# EAGLE schematic alu3 2 (EAGLE 7.6.0)
ALU

## Sheet 1 of 8: ALU CORE
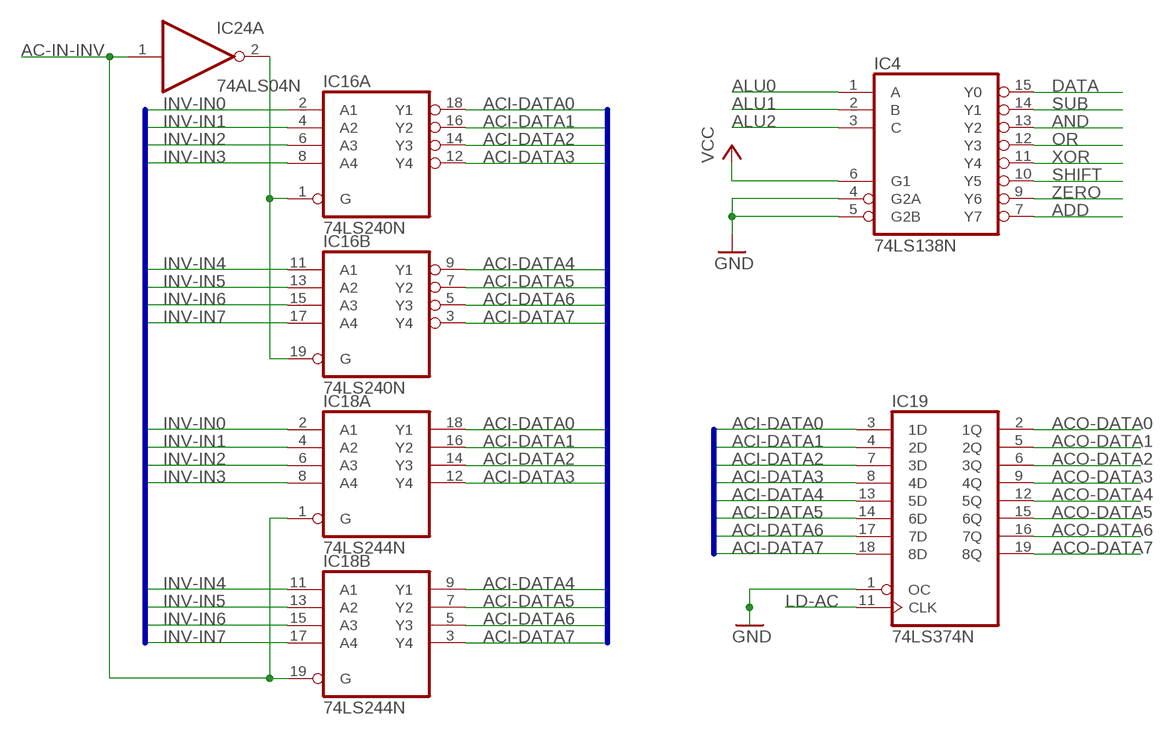
[diagram p0: schematic, sheet 1]

### Parts
IC4  74LS138N  [DIL16]
IC16  74LS240N  [DIL20]
IC18  74LS244N  [DIL20]
IC19  74LS374N  [DIL20]
IC24  74ALS04N  [DIL14]

### Nets
AC-IN-INV: IC18.1(A:G) IC18.19(B:G) IC24.1(A:I) ; also sheet 2,6
ACI-DATA0: IC16.18(A:Y1) IC18.18(A:Y1) IC19.3(1D)
ACI-DATA1: IC16.16(A:Y2) IC18.16(A:Y2) IC19.4(2D)
ACI-DATA2: IC16.14(A:Y3) IC18.14(A:Y3) IC19.7(3D)
ACI-DATA3: IC16.12(A:Y4) IC18.12(A:Y4) IC19.8(4D)
ACI-DATA4: IC16.9(B:Y1) IC18.9(B:Y1) IC19.13(5D)
ACI-DATA5: IC16.7(B:Y2) IC18.7(B:Y2) IC19.14(6D)
ACI-DATA6: IC16.5(B:Y3) IC18.5(B:Y3) IC19.17(7D)
ACI-DATA7: IC16.3(B:Y4) IC18.3(B:Y4) IC19.18(8D)
ACO-DATA0: IC19.2(1Q) ; also sheet 4,5,6,8
ACO-DATA1: IC19.5(2Q) ; also sheet 4,5,6,8
ACO-DATA2: IC19.6(3Q) ; also sheet 4,5,6,8
ACO-DATA3: IC19.9(4Q) ; also sheet 4,5,6,8
ACO-DATA4: IC19.12(5Q) ; also sheet 4,5,6,8
ACO-DATA5: IC19.15(6Q) ; also sheet 4,5,6,8
ACO-DATA6: IC19.16(7Q) ; also sheet 4,5,6,8
ACO-DATA7: IC19.19(8Q) ; also sheet 4,5,6,8
ADD: IC4.7(Y7) ; also sheet 8
ALU0: IC4.1(A) ; also sheet 2,6,7
ALU1: IC4.2(B) ; also sheet 2,6,7
ALU2: IC4.3(C) ; also sheet 2,6,7
AND: IC4.13(Y2) ; also sheet 5
DATA: IC4.15(Y0) ; also sheet 4
GND: IC4.4(G2A) IC4.5(G2B) IC19.1(OC) ; also sheet 2,5,6,7
INV-IN0: IC16.2(A:A1) IC18.2(A:A1) ; also sheet 4,5,7,8
INV-IN1: IC16.4(A:A2) IC18.4(A:A2) ; also sheet 4,5,7,8
INV-IN2: IC16.6(A:A3) IC18.6(A:A3) ; also sheet 4,5,7,8
INV-IN3: IC16.8(A:A4) IC18.8(A:A4) ; also sheet 4,5,7,8
INV-IN4: IC16.11(B:A1) IC18.11(B:A1) ; also sheet 4,5,7,8
INV-IN5: IC16.13(B:A2) IC18.13(B:A2) ; also sheet 4,5,7,8
INV-IN6: IC16.15(B:A3) IC18.15(B:A3) ; also sheet 4,5,7,8
INV-IN7: IC16.17(B:A4) IC18.17(B:A4) ; also sheet 4,5,7,8
LD-AC: IC19.11(CLK) ; also sheet 2
N$42: IC16.1(A:G) IC16.19(B:G) IC24.2(A:O)
OR: IC4.12(Y3) ; also sheet 5
SHIFT: IC4.10(Y5) ; also sheet 7
SUB: IC4.14(Y1) ; also sheet 8
VCC: IC4.6(G1) ; also sheet 2,6,7
XOR: IC4.11(Y4) ; also sheet 5
ZERO: IC4.9(Y6) ; also sheet 5
Unconnected: IC24.12(F:O) IC24.13(F:I)

### Buses
INV-IN[0..7]
ACI-DATA[0..7]

## Sheet 2 of 8: BUS
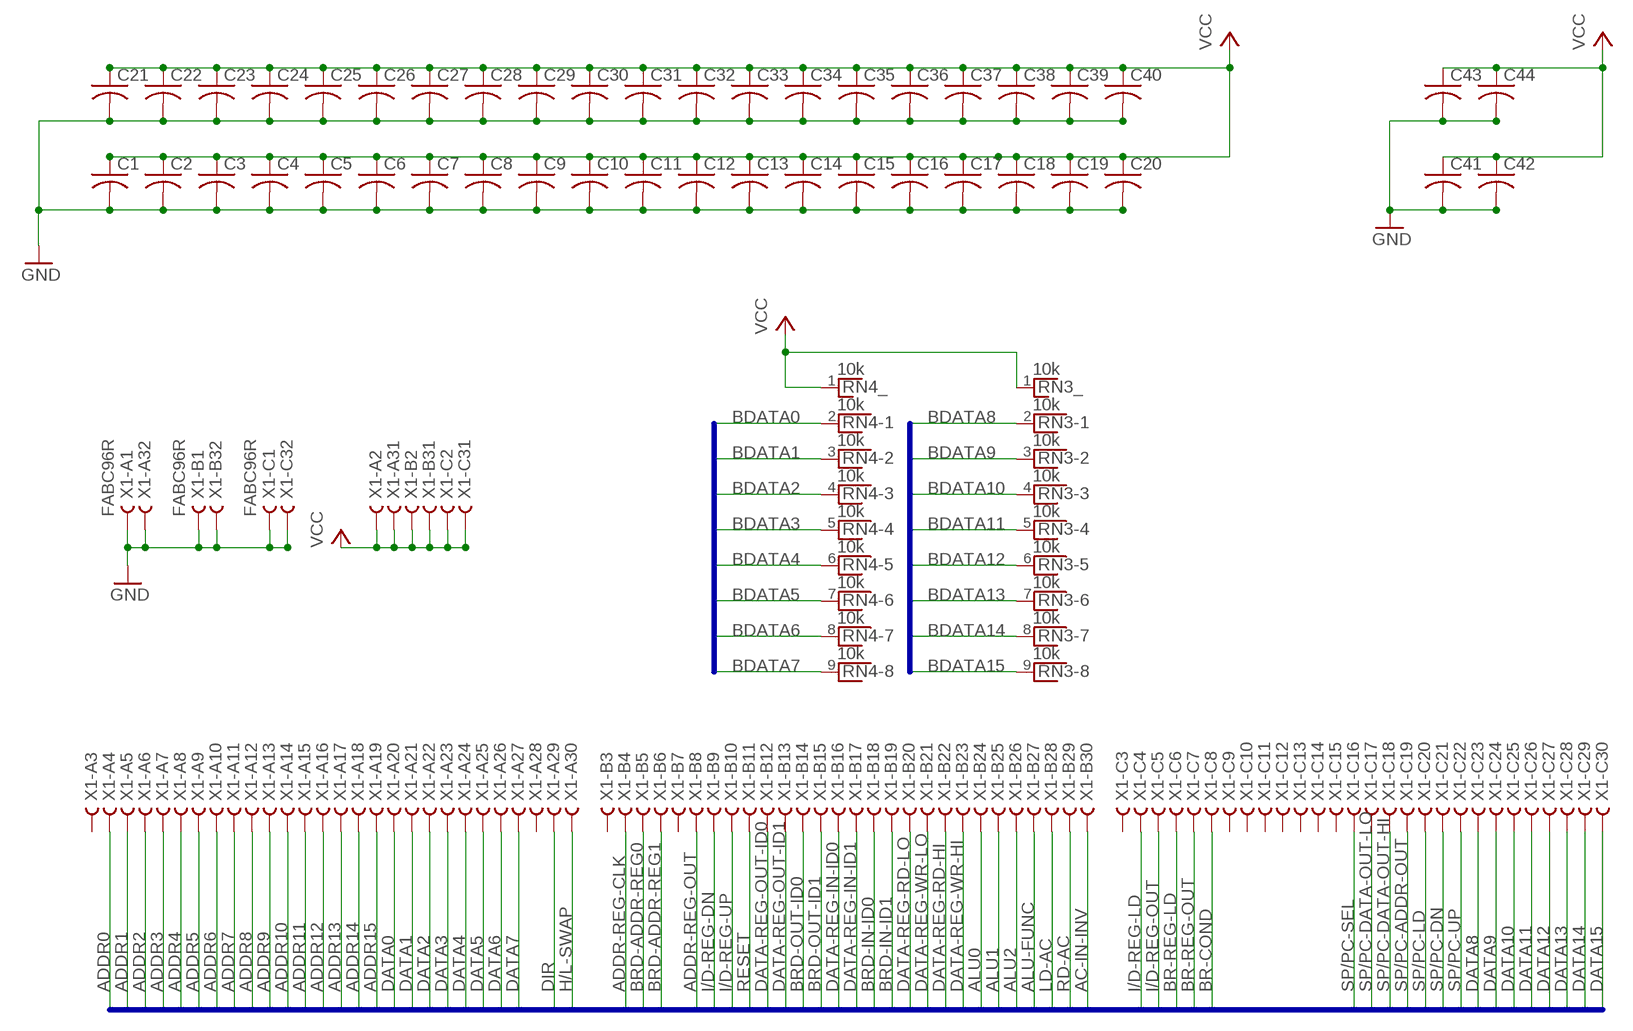
[diagram p1: schematic, sheet 2]

### Parts
C1  C-US025-024X044  [C025-024X044]
C2  C-US025-024X044  [C025-024X044]
C3  C-US025-024X044  [C025-024X044]
C4  C-US025-024X044  [C025-024X044]
C5  C-US025-024X044  [C025-024X044]
C6  C-US025-024X044  [C025-024X044]
C7  C-US025-024X044  [C025-024X044]
C8  C-US025-024X044  [C025-024X044]
C9  C-US025-024X044  [C025-024X044]
C10  C-US025-024X044  [C025-024X044]
C11  C-US025-024X044  [C025-024X044]
C12  C-US025-024X044  [C025-024X044]
C13  C-US025-024X044  [C025-024X044]
C14  C-US025-024X044  [C025-024X044]
C15  C-US025-024X044  [C025-024X044]
C16  C-US025-024X044  [C025-024X044]
C17  C-US025-024X044  [C025-024X044]
C18  C-US025-024X044  [C025-024X044]
C19  C-US025-024X044  [C025-024X044]
C20  C-US025-024X044  [C025-024X044]
C21  C-US025-024X044  [C025-024X044]
C22  C-US025-024X044  [C025-024X044]
C23  C-US025-024X044  [C025-024X044]
C24  C-US025-024X044  [C025-024X044]
C25  C-US025-024X044  [C025-024X044]
C26  C-US025-024X044  [C025-024X044]
C27  C-US025-024X044  [C025-024X044]
C28  C-US025-024X044  [C025-024X044]
C29  C-US025-024X044  [C025-024X044]
C30  C-US025-024X044  [C025-024X044]
C31  C-US025-024X044  [C025-024X044]
C32  C-US025-024X044  [C025-024X044]
C33  C-US025-024X044  [C025-024X044]
C34  C-US025-024X044  [C025-024X044]
C35  C-US025-024X044  [C025-024X044]
C36  C-US025-024X044  [C025-024X044]
C37  C-US025-024X044  [C025-024X044]
C38  C-US025-024X044  [C025-024X044]
C39  C-US025-024X044  [C025-024X044]
C40  C-US025-024X044  [C025-024X044]
C41  C-US025-024X044  [C025-024X044]
C42  C-US025-024X044  [C025-024X044]
C43  C-US025-024X044  [C025-024X044]
C44  C-US025-024X044  [C025-024X044]
RN3  10k  RNX8  [RN-9]
RN4  10k  RNX8  [RN-9]
X1  FABC96R  [FABC96R]

### Nets
AC-IN-INV: X1.B30 ; also sheet 1,6
ADDR0: X1.A4
ADDR1: X1.A5
ADDR2: X1.A6
ADDR3: X1.A7
ADDR4: X1.A8
ADDR5: X1.A9
ADDR6: X1.A10
ADDR7: X1.A11
ADDR8: X1.A12
ADDR9: X1.A13
ADDR10: X1.A14
ADDR11: X1.A15
ADDR12: X1.A16
ADDR13: X1.A17
ADDR14: X1.A18
ADDR15: X1.A19
ADDR-REG-CLK: X1.B4
ADDR-REG-OUT: X1.B8
ALU0: X1.B24 ; also sheet 1,6,7
ALU1: X1.B25 ; also sheet 1,6,7
ALU2: X1.B26 ; also sheet 1,6,7
ALU-FUNC: X1.B27 ; also sheet 4
BDATA0: RN4.2 ; also sheet 3,4,5,6,8
BDATA1: RN4.3 ; also sheet 3,4,5,6,8
BDATA2: RN4.4 ; also sheet 3,4,5,6,8
BDATA3: RN4.5 ; also sheet 3,4,5,6,7,8
BDATA4: RN4.6 ; also sheet 3,4,5,6,7,8
BDATA5: RN4.7 ; also sheet 3,4,5,6,8
BDATA6: RN4.8 ; also sheet 3,4,5,6,8
BDATA7: RN4.9 ; also sheet 3,4,5,6,8
BDATA8: RN3.2 ; also sheet 3,4,6
BDATA9: RN3.3 ; also sheet 3,4,6
BDATA10: RN3.4 ; also sheet 3,4,6
BDATA11: RN3.5 ; also sheet 3,4,6
BDATA12: RN3.6 ; also sheet 3,4,6
BDATA13: RN3.7 ; also sheet 3,4,6
BDATA14: RN3.8 ; also sheet 3,4,6
BDATA15: RN3.9 ; also sheet 3,4,6
BR-COND: X1.C8 ; also sheet 6
BR-REG-LD: X1.C6
BR-REG-OUT: X1.C7
BRD-ADDR-REG0: X1.B5
BRD-ADDR-REG1: X1.B6
BRD-IN-ID0: X1.B18
BRD-IN-ID1: X1.B19
BRD-OUT-ID0: X1.B14
BRD-OUT-ID1: X1.B15
DATA0: X1.A20 ; also sheet 4
DATA1: X1.A21 ; also sheet 4
DATA2: X1.A22 ; also sheet 4
DATA3: X1.A23 ; also sheet 4
DATA4: X1.A24 ; also sheet 4
DATA5: X1.A25 ; also sheet 4
DATA6: X1.A26 ; also sheet 4
DATA7: X1.A27 ; also sheet 4
DATA8: X1.C23 ; also sheet 4
DATA9: X1.C24 ; also sheet 4
DATA10: X1.C25 ; also sheet 4
DATA11: X1.C26 ; also sheet 4
DATA12: X1.C27 ; also sheet 4
DATA13: X1.C28 ; also sheet 4
DATA14: X1.C29 ; also sheet 4
DATA15: X1.C30 ; also sheet 4
DATA-REG-IN-ID0: X1.B16
DATA-REG-IN-ID1: X1.B17
DATA-REG-OUT-ID0: X1.B12
DATA-REG-OUT-ID1: X1.B13
DATA-REG-RD-HI: X1.B22
DATA-REG-RD-LO: X1.B20
DATA-REG-WR-HI: X1.B23
DATA-REG-WR-LO: X1.B21
DIR: X1.A29 ; also sheet 4
GND: C1.2 C2.2 C3.2 C4.2 C5.2 C6.2 C7.2 C8.2 C9.2 C10.2 C11.2 C12.2 C13.2 C14.2 C15.2 C16.2 C17.2 C18.2 C19.2 C20.2 C21.2 C22.2 C23.2 C24.2 C25.2 C26.2 C27.2 C28.2 C29.2 C30.2 C31.2 C32.2 C33.2 C34.2 C35.2 C36.2 C37.2 C38.2 C39.2 C40.2 C41.2 C42.2 C43.2 C44.2 X1.A1 X1.A32 X1.B1 X1.B32 X1.C1 X1.C32 ; also sheet 1,5,6,7
H/L-SWAP: X1.A30
I/D-REG-DN: X1.B9 ; also sheet 3
I/D-REG-LD: X1.C4 ; also sheet 3
I/D-REG-OUT: X1.C5 ; also sheet 3
I/D-REG-UP: X1.B10 ; also sheet 3
LD-AC: X1.B28 ; also sheet 1
RD-AC: X1.B29 ; also sheet 4
RESET: X1.B11 ; also sheet 3
SP/PC-ADDR-OUT: X1.C19
SP/PC-DATA-OUT-HI: X1.C18
SP/PC-DATA-OUT-LO: X1.C17
SP/PC-DN: X1.C21
SP/PC-LD: X1.C20
SP/PC-SEL: X1.C16
SP/PC-UP: X1.C22
VCC: C1.1 C2.1 C3.1 C4.1 C5.1 C6.1 C7.1 C8.1 C9.1 C10.1 C11.1 C12.1 C13.1 C14.1 C15.1 C16.1 C17.1 C18.1 C19.1 C20.1 C21.1 C22.1 C23.1 C24.1 C25.1 C26.1 C27.1 C28.1 C29.1 C30.1 C31.1 C32.1 C33.1 C34.1 C35.1 C36.1 C37.1 C38.1 C39.1 C40.1 C41.1 C42.1 C43.1 C44.1 RN3.1 RN4.1 X1.A2 X1.A31 X1.B2 X1.B31 X1.C2 X1.C31 ; also sheet 1,6,7
Unconnected: X1.A3 X1.A28 X1.B3 X1.B7 X1.C3 X1.C9 X1.C10 X1.C11 X1.C12 X1.C13 X1.C14 X1.C15

### Buses
ADDR[0..15],DATA[0..15],DIR,H/L-SWAP,ADDR-REG-CLK,BRD-ADDR-REG[0..1],ADDR-REG-OUT,I/D-REG-DN,I/D-REG-UP,RESET,DATA-REG-OUT-ID[0..1],BRD-OUT-ID[0..1],DATA-REG-IN-ID[0..1],BRD-IN-ID[0..1],DATA-REG-RD-LO,DATA-REG-WR-LO,DATA-REG-RD-HI,DATA-REG-WR-HI,ALU[0..2],ALU-FUNC,LD-AC,RD-AC,AC-IN-INV,I/D-REG-LD,I/D-REG-OUT,BR-REG-LD,BR-REG-OUT,BR-COND,SP/PC-SEL,SP/PC-DATA-OUT-LO,SP/PC-DATA-OUT-HI,SP/PC-ADDR-OUT,SP/PC-LD,SP/PC-DN,SP/PC-UP
BDATA[0..15]

## Sheet 3 of 8: Reg INC/DEC
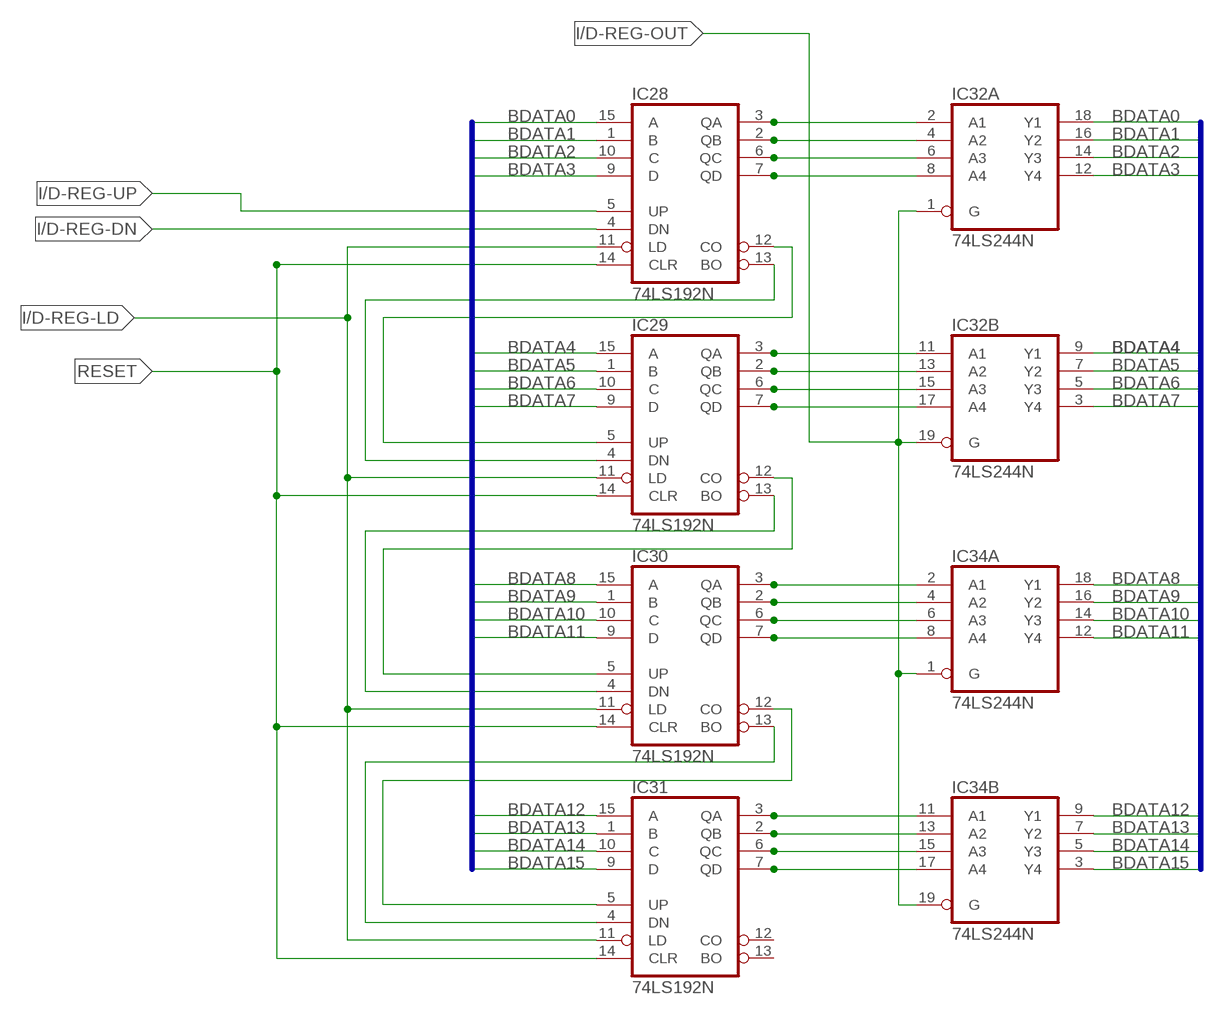
[diagram p2: schematic, sheet 3]

### Parts
IC28  74LS192N  [DIL16]
IC29  74LS192N  [DIL16]
IC30  74LS192N  [DIL16]
IC31  74LS192N  [DIL16]
IC32  74LS244N  [DIL20]
IC34  74LS244N  [DIL20]

### Nets
BDATA0: IC28.15(A) IC32.18(A:Y1) ; also sheet 2,4,5,6,8
BDATA1: IC28.1(B) IC32.16(A:Y2) ; also sheet 2,4,5,6,8
BDATA2: IC28.10(C) IC32.14(A:Y3) ; also sheet 2,4,5,6,8
BDATA3: IC28.9(D) IC32.12(A:Y4) ; also sheet 2,4,5,6,7,8
BDATA4: IC29.15(A) IC32.9(B:Y1) ; also sheet 2,4,5,6,7,8
BDATA5: IC29.1(B) IC32.7(B:Y2) ; also sheet 2,4,5,6,8
BDATA6: IC29.10(C) IC32.5(B:Y3) ; also sheet 2,4,5,6,8
BDATA7: IC29.9(D) IC32.3(B:Y4) ; also sheet 2,4,5,6,8
BDATA8: IC30.15(A) IC34.18(A:Y1) ; also sheet 2,4,6
BDATA9: IC30.1(B) IC34.16(A:Y2) ; also sheet 2,4,6
BDATA10: IC30.10(C) IC34.14(A:Y3) ; also sheet 2,4,6
BDATA11: IC30.9(D) IC34.12(A:Y4) ; also sheet 2,4,6
BDATA12: IC31.15(A) IC34.9(B:Y1) ; also sheet 2,4,6
BDATA13: IC31.1(B) IC34.7(B:Y2) ; also sheet 2,4,6
BDATA14: IC31.10(C) IC34.5(B:Y3) ; also sheet 2,4,6
BDATA15: IC31.9(D) IC34.3(B:Y4) ; also sheet 2,4,6
I/D-REG-DN: IC28.4(DN) ; also sheet 2
I/D-REG-LD: IC28.11(LD) IC29.11(LD) IC30.11(LD) IC31.11(LD) ; also sheet 2
I/D-REG-OUT: IC32.1(A:G) IC32.19(B:G) IC34.1(A:G) IC34.19(B:G) ; also sheet 2
I/D-REG-UP: IC28.5(UP) ; also sheet 2
N$58: IC28.13(BO) IC29.4(DN)
N$59: IC28.12(CO) IC29.5(UP)
N$60: IC29.13(BO) IC30.4(DN)
N$61: IC29.12(CO) IC30.5(UP)
N$62: IC30.13(BO) IC31.4(DN)
N$63: IC30.12(CO) IC31.5(UP)
R1D0: IC28.7(QD) IC32.8(A:A4)
R1D1: IC28.6(QC) IC32.6(A:A3)
R1D2: IC28.2(QB) IC32.4(A:A2)
R1D3: IC28.3(QA) IC32.2(A:A1)
R1D4: IC29.7(QD) IC32.17(B:A4)
R1D5: IC29.6(QC) IC32.15(B:A3)
R1D6: IC29.2(QB) IC32.13(B:A2)
R1D7: IC29.3(QA) IC32.11(B:A1)
R1D8: IC30.7(QD) IC34.8(A:A4)
R1D9: IC30.6(QC) IC34.6(A:A3)
R1D10: IC30.2(QB) IC34.4(A:A2)
R1D11: IC30.3(QA) IC34.2(A:A1)
R1D12: IC31.7(QD) IC34.17(B:A4)
R1D13A: IC31.6(QC) IC34.15(B:A3)
R1D14: IC31.2(QB) IC34.13(B:A2)
R1D15: IC31.3(QA) IC34.11(B:A1)
RESET: IC28.14(CLR) IC29.14(CLR) IC30.14(CLR) IC31.14(CLR) ; also sheet 2
Unconnected: IC31.12(CO) IC31.13(BO)

### Buses
BDATA[0..15]

## Sheet 4 of 8: Bus Buffering
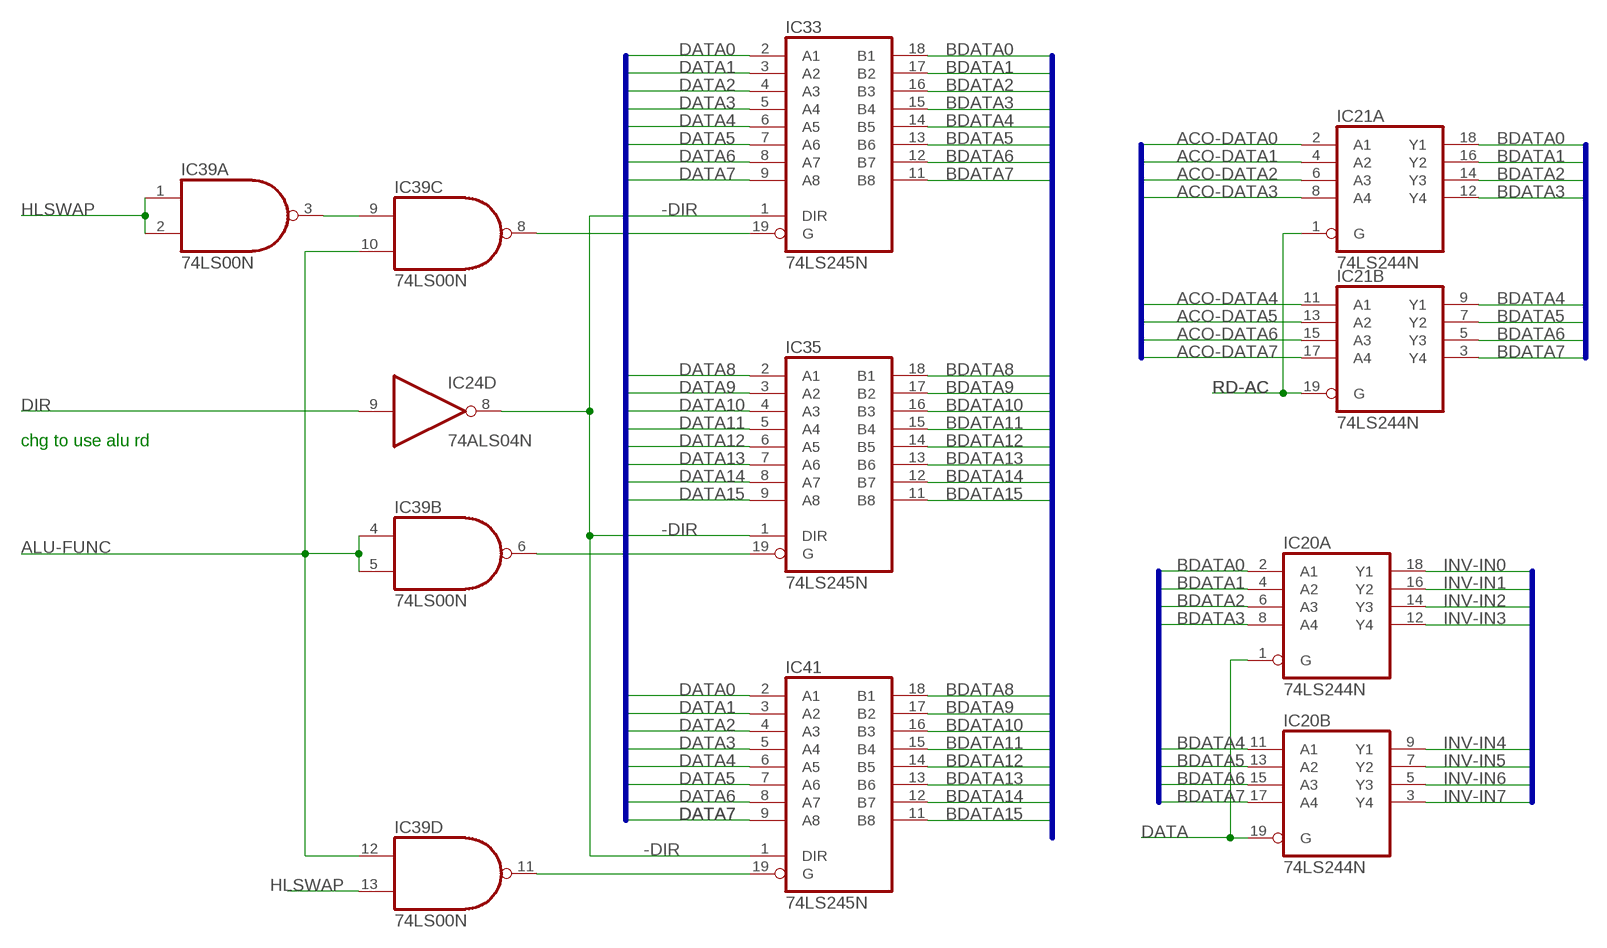
[diagram p3: schematic, sheet 4]

### Parts
IC20  74LS244N  [DIL20]
IC21  74LS244N  [DIL20]
IC33  74LS245N  [DIL20]
IC35  74LS245N  [DIL20]
IC39  74LS00N  [DIL14]
IC41  74LS245N  [DIL20]

### Nets
-DIR: IC24.8(D:O) IC33.1(DIR) IC35.1(DIR) IC41.1(DIR)
ACO-DATA0: IC21.2(A:A1) ; also sheet 1,5,6,8
ACO-DATA1: IC21.4(A:A2) ; also sheet 1,5,6,8
ACO-DATA2: IC21.6(A:A3) ; also sheet 1,5,6,8
ACO-DATA3: IC21.8(A:A4) ; also sheet 1,5,6,8
ACO-DATA4: IC21.11(B:A1) ; also sheet 1,5,6,8
ACO-DATA5: IC21.13(B:A2) ; also sheet 1,5,6,8
ACO-DATA6: IC21.15(B:A3) ; also sheet 1,5,6,8
ACO-DATA7: IC21.17(B:A4) ; also sheet 1,5,6,8
ALU-FUNC: IC39.4(B:I0) IC39.5(B:I1) IC39.10(C:I1) IC39.12(D:I0) ; also sheet 2
BDATA0: IC20.2(A:A1) IC21.18(A:Y1) IC33.18(B1) ; also sheet 2,3,5,6,8
BDATA1: IC20.4(A:A2) IC21.16(A:Y2) IC33.17(B2) ; also sheet 2,3,5,6,8
BDATA2: IC20.6(A:A3) IC21.14(A:Y3) IC33.16(B3) ; also sheet 2,3,5,6,8
BDATA3: IC20.8(A:A4) IC21.12(A:Y4) IC33.15(B4) ; also sheet 2,3,5,6,7,8
BDATA4: IC20.11(B:A1) IC21.9(B:Y1) IC33.14(B5) ; also sheet 2,3,5,6,7,8
BDATA5: IC20.13(B:A2) IC21.7(B:Y2) IC33.13(B6) ; also sheet 2,3,5,6,8
BDATA6: IC20.15(B:A3) IC21.5(B:Y3) IC33.12(B7) ; also sheet 2,3,5,6,8
BDATA7: IC20.17(B:A4) IC21.3(B:Y4) IC33.11(B8) ; also sheet 2,3,5,6,8
BDATA8: IC35.18(B1) IC41.18(B1) ; also sheet 2,3,6
BDATA9: IC35.17(B2) IC41.17(B2) ; also sheet 2,3,6
BDATA10: IC35.16(B3) IC41.16(B3) ; also sheet 2,3,6
BDATA11: IC35.15(B4) IC41.15(B4) ; also sheet 2,3,6
BDATA12: IC35.14(B5) IC41.14(B5) ; also sheet 2,3,6
BDATA13: IC35.13(B6) IC41.13(B6) ; also sheet 2,3,6
BDATA14: IC35.12(B7) IC41.12(B7) ; also sheet 2,3,6
BDATA15: IC35.11(B8) IC41.11(B8) ; also sheet 2,3,6
DATA: IC20.1(A:G) IC20.19(B:G) ; also sheet 1
DATA0: IC33.2(A1) IC41.2(A1) ; also sheet 2
DATA1: IC33.3(A2) IC41.3(A2) ; also sheet 2
DATA2: IC33.4(A3) IC41.4(A3) ; also sheet 2
DATA3: IC33.5(A4) IC41.5(A4) ; also sheet 2
DATA4: IC33.6(A5) IC41.6(A5) ; also sheet 2
DATA5: IC33.7(A6) IC41.7(A6) ; also sheet 2
DATA6: IC33.8(A7) IC41.8(A7) ; also sheet 2
DATA7: IC33.9(A8) IC41.9(A8) ; also sheet 2
DATA8: IC35.2(A1) ; also sheet 2
DATA9: IC35.3(A2) ; also sheet 2
DATA10: IC35.4(A3) ; also sheet 2
DATA11: IC35.5(A4) ; also sheet 2
DATA12: IC35.6(A5) ; also sheet 2
DATA13: IC35.7(A6) ; also sheet 2
DATA14: IC35.8(A7) ; also sheet 2
DATA15: IC35.9(A8) ; also sheet 2
DIR: IC24.9(D:I) ; also sheet 2
HLSWAP: IC39.1(A:I0) IC39.2(A:I1) IC39.13(D:I1)
INV-IN0: IC20.18(A:Y1) ; also sheet 1,5,7,8
INV-IN1: IC20.16(A:Y2) ; also sheet 1,5,7,8
INV-IN2: IC20.14(A:Y3) ; also sheet 1,5,7,8
INV-IN3: IC20.12(A:Y4) ; also sheet 1,5,7,8
INV-IN4: IC20.9(B:Y1) ; also sheet 1,5,7,8
INV-IN5: IC20.7(B:Y2) ; also sheet 1,5,7,8
INV-IN6: IC20.5(B:Y3) ; also sheet 1,5,7,8
INV-IN7: IC20.3(B:Y4) ; also sheet 1,5,7,8
N$64: IC35.19(G) IC39.6(B:O)
N$65: IC33.19(G) IC39.8(C:O)
N$67: IC39.11(D:O) IC41.19(G)
N$68: IC39.3(A:O) IC39.9(C:I0)
RD-AC: IC21.1(A:G) IC21.19(B:G) ; also sheet 2

### Buses
BDATA[0..15]
DATA[0..15]
INV-IN[0..7]
BDATA[0..7]
ACO-DATA[0..7]

### Notes on the sheet
- chg to use alu rd

## Sheet 5 of 8: Logical
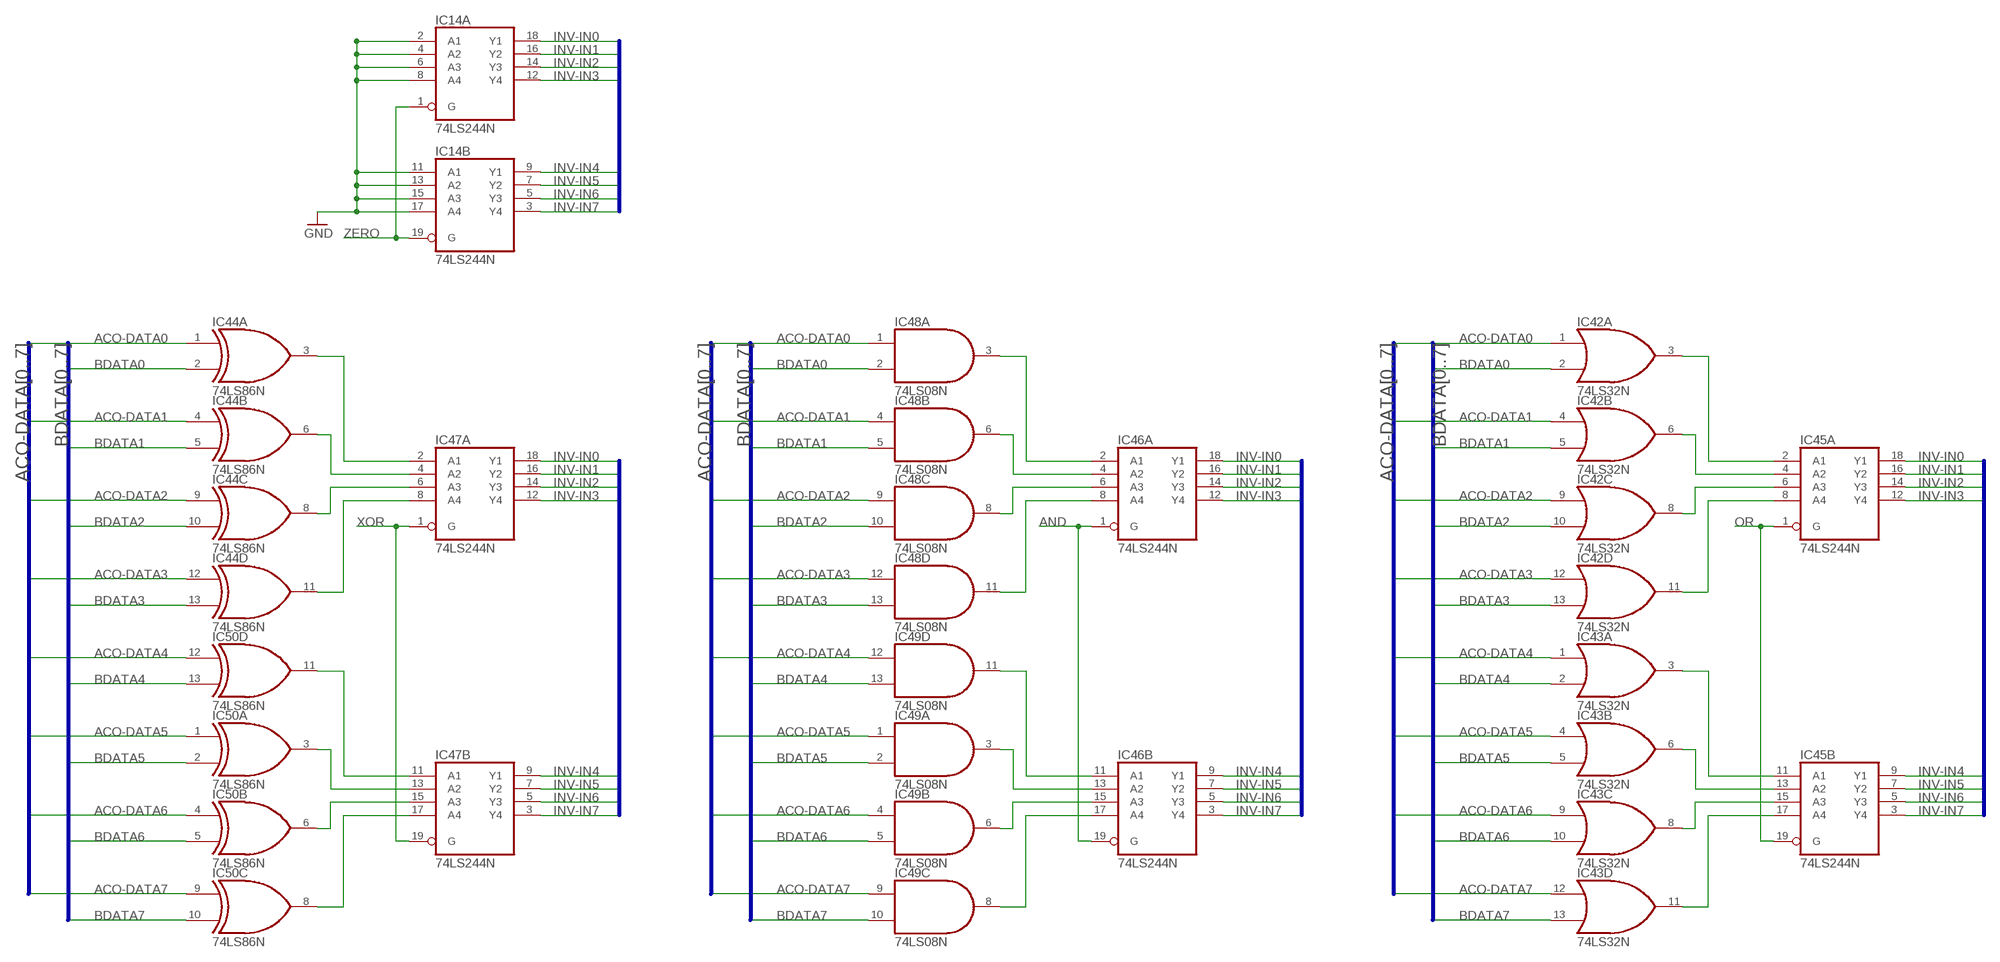
[diagram p4: schematic, sheet 5]

### Parts
IC14  74LS244N  [DIL20]
IC42  74LS32N  [DIL14]
IC43  74LS32N  [DIL14]
IC44  74LS86N  [DIL14]
IC45  74LS244N  [DIL20]
IC46  74LS244N  [DIL20]
IC47  74LS244N  [DIL20]
IC48  74LS08N  [DIL14]
IC49  74LS08N  [DIL14]
IC50  74LS86N  [DIL14]

### Nets
ACO-DATA0: IC42.1(A:I0) IC44.1(A:I0) IC48.1(A:I0) ; also sheet 1,4,6,8
ACO-DATA1: IC42.4(B:I0) IC44.4(B:I0) IC48.4(B:I0) ; also sheet 1,4,6,8
ACO-DATA2: IC42.9(C:I0) IC44.9(C:I0) IC48.9(C:I0) ; also sheet 1,4,6,8
ACO-DATA3: IC42.12(D:I0) IC44.12(D:I0) IC48.12(D:I0) ; also sheet 1,4,6,8
ACO-DATA4: IC43.1(A:I0) IC49.12(D:I0) IC50.12(D:I0) ; also sheet 1,4,6,8
ACO-DATA5: IC43.4(B:I0) IC49.1(A:I0) IC50.1(A:I0) ; also sheet 1,4,6,8
ACO-DATA6: IC43.9(C:I0) IC49.4(B:I0) IC50.4(B:I0) ; also sheet 1,4,6,8
ACO-DATA7: IC43.12(D:I0) IC49.9(C:I0) IC50.9(C:I0) ; also sheet 1,4,6,8
AND: IC46.1(A:G) IC46.19(B:G) ; also sheet 1
BDATA0: IC42.2(A:I1) IC44.2(A:I1) IC48.2(A:I1) ; also sheet 2,3,4,6,8
BDATA1: IC42.5(B:I1) IC44.5(B:I1) IC48.5(B:I1) ; also sheet 2,3,4,6,8
BDATA2: IC42.10(C:I1) IC44.10(C:I1) IC48.10(C:I1) ; also sheet 2,3,4,6,8
BDATA3: IC42.13(D:I1) IC44.13(D:I1) IC48.13(D:I1) ; also sheet 2,3,4,6,7,8
BDATA4: IC43.2(A:I1) IC49.13(D:I1) IC50.13(D:I1) ; also sheet 2,3,4,6,7,8
BDATA5: IC43.5(B:I1) IC49.2(A:I1) IC50.2(A:I1) ; also sheet 2,3,4,6,8
BDATA6: IC43.10(C:I1) IC49.5(B:I1) IC50.5(B:I1) ; also sheet 2,3,4,6,8
BDATA7: IC43.13(D:I1) IC49.10(C:I1) IC50.10(C:I1) ; also sheet 2,3,4,6,8
GND: IC14.2(A:A1) IC14.4(A:A2) IC14.6(A:A3) IC14.8(A:A4) IC14.11(B:A1) IC14.13(B:A2) IC14.15(B:A3) IC14.17(B:A4) ; also sheet 1,2,6,7
INV-IN0: IC14.18(A:Y1) IC45.18(A:Y1) IC46.18(A:Y1) IC47.18(A:Y1) ; also sheet 1,4,7,8
INV-IN1: IC14.16(A:Y2) IC45.16(A:Y2) IC46.16(A:Y2) IC47.16(A:Y2) ; also sheet 1,4,7,8
INV-IN2: IC14.14(A:Y3) IC45.14(A:Y3) IC46.14(A:Y3) IC47.14(A:Y3) ; also sheet 1,4,7,8
INV-IN3: IC14.12(A:Y4) IC45.12(A:Y4) IC46.12(A:Y4) IC47.12(A:Y4) ; also sheet 1,4,7,8
INV-IN4: IC14.9(B:Y1) IC45.9(B:Y1) IC46.9(B:Y1) IC47.9(B:Y1) ; also sheet 1,4,7,8
INV-IN5: IC14.7(B:Y2) IC45.7(B:Y2) IC46.7(B:Y2) IC47.7(B:Y2) ; also sheet 1,4,7,8
INV-IN6: IC14.5(B:Y3) IC45.5(B:Y3) IC46.5(B:Y3) IC47.5(B:Y3) ; also sheet 1,4,7,8
INV-IN7: IC14.3(B:Y4) IC45.3(B:Y4) IC46.3(B:Y4) IC47.3(B:Y4) ; also sheet 1,4,7,8
N$77: IC42.3(A:O) IC45.2(A:A1)
N$78: IC42.6(B:O) IC45.4(A:A2)
N$79: IC42.8(C:O) IC45.6(A:A3)
N$81: IC42.11(D:O) IC45.8(A:A4)
N$82: IC43.3(A:O) IC45.11(B:A1)
N$83: IC43.6(B:O) IC45.13(B:A2)
N$84: IC43.8(C:O) IC45.15(B:A3)
N$85: IC43.11(D:O) IC45.17(B:A4)
N$86: IC46.2(A:A1) IC48.3(A:O)
N$87: IC46.4(A:A2) IC48.6(B:O)
N$88: IC46.6(A:A3) IC48.8(C:O)
N$89: IC46.8(A:A4) IC48.11(D:O)
N$90: IC46.11(B:A1) IC49.11(D:O)
N$91: IC46.13(B:A2) IC49.3(A:O)
N$92: IC46.15(B:A3) IC49.6(B:O)
N$93: IC46.17(B:A4) IC49.8(C:O)
N$94: IC44.3(A:O) IC47.2(A:A1)
N$95: IC44.6(B:O) IC47.4(A:A2)
N$96: IC44.8(C:O) IC47.6(A:A3)
N$97: IC44.11(D:O) IC47.8(A:A4)
N$98: IC47.11(B:A1) IC50.11(D:O)
N$99: IC47.13(B:A2) IC50.3(A:O)
N$100: IC47.15(B:A3) IC50.6(B:O)
N$101: IC47.17(B:A4) IC50.8(C:O)
OR: IC45.1(A:G) IC45.19(B:G) ; also sheet 1
XOR: IC47.1(A:G) IC47.19(B:G) ; also sheet 1
ZERO: IC14.1(A:G) IC14.19(B:G) ; also sheet 1

### Buses
INV-IN[0..7]
ACO-DATA[0..7]
BDATA[0..7]

## Sheet 6 of 8: Compare
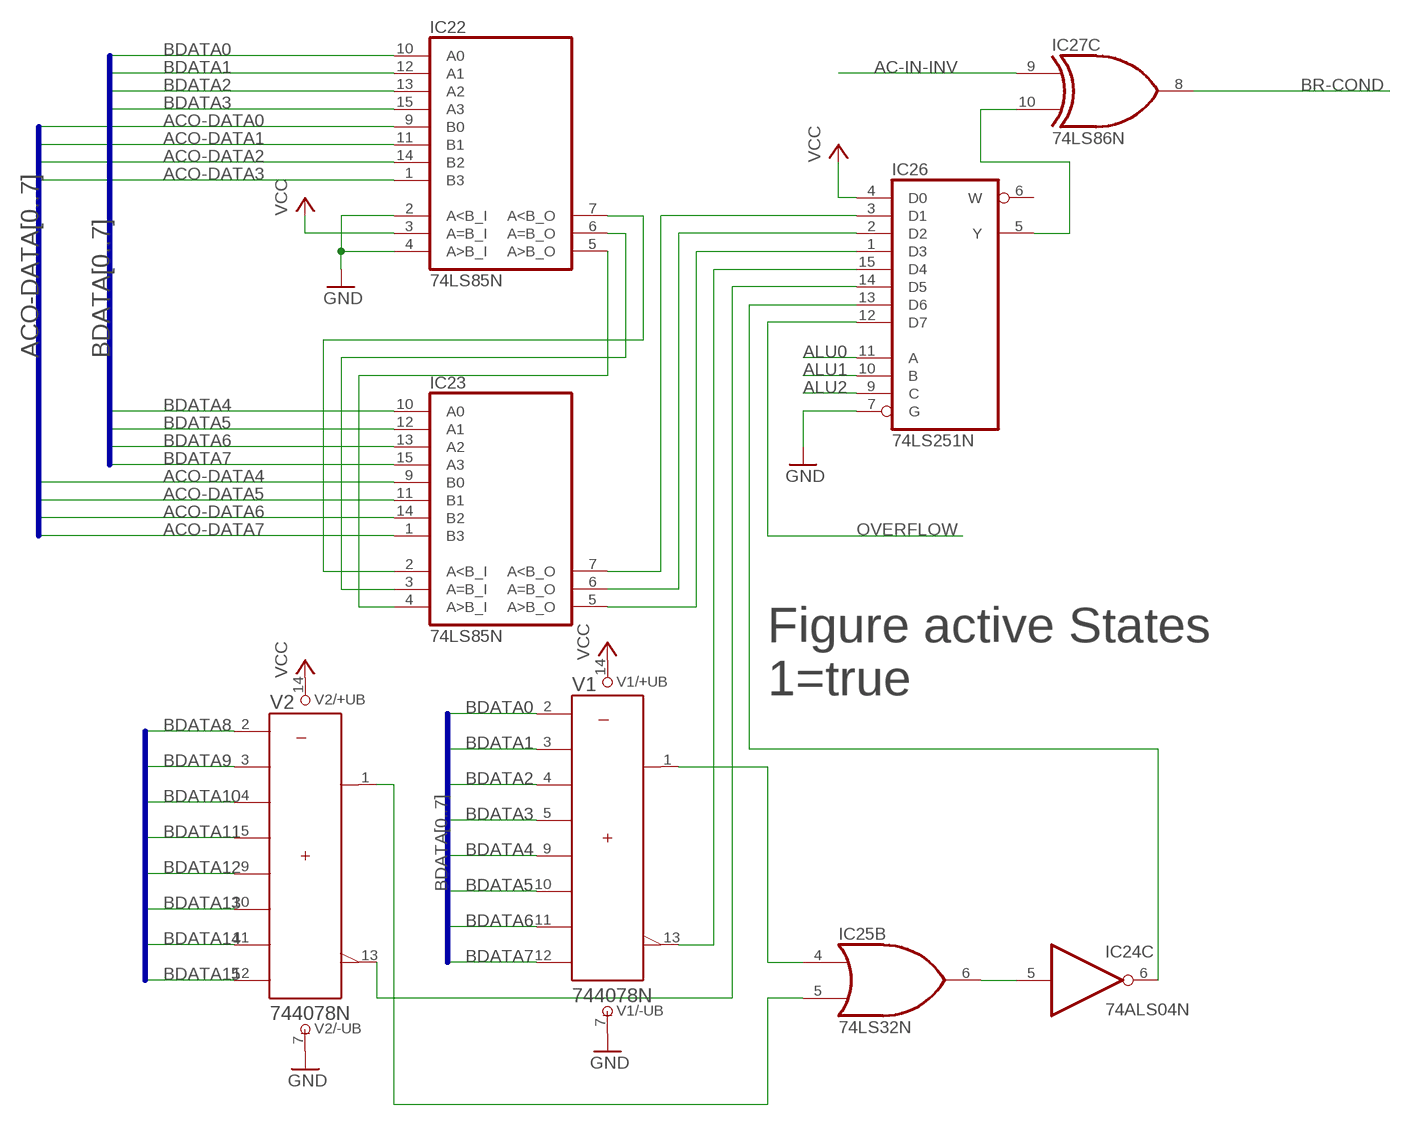
[diagram p5: schematic, sheet 6]

### Parts
IC22  74LS85N  [DIL16]
IC23  74LS85N  [DIL16]
IC25  74LS32N  [DIL14]
IC26  74LS251N  [DIL16]
IC27  74LS86N  [DIL14]
V1  744078N  [DIL14]
V2  744078N  [DIL14]

### Nets
AC-IN-INV: IC27.9(C:I0) ; also sheet 1,2
ACO-DATA0: IC22.9(B0) ; also sheet 1,4,5,8
ACO-DATA1: IC22.11(B1) ; also sheet 1,4,5,8
ACO-DATA2: IC22.14(B2) ; also sheet 1,4,5,8
ACO-DATA3: IC22.1(B3) ; also sheet 1,4,5,8
ACO-DATA4: IC23.9(B0) ; also sheet 1,4,5,8
ACO-DATA5: IC23.11(B1) ; also sheet 1,4,5,8
ACO-DATA6: IC23.14(B2) ; also sheet 1,4,5,8
ACO-DATA7: IC23.1(B3) ; also sheet 1,4,5,8
ALU0: IC26.11(A) ; also sheet 1,2,7
ALU1: IC26.10(B) ; also sheet 1,2,7
ALU2: IC26.9(C) ; also sheet 1,2,7
BDATA0: IC22.10(A0) V1.2(A) ; also sheet 2,3,4,5,8
BDATA1: IC22.12(A1) V1.3(B) ; also sheet 2,3,4,5,8
BDATA2: IC22.13(A2) V1.4(C) ; also sheet 2,3,4,5,8
BDATA3: IC22.15(A3) V1.5(D) ; also sheet 2,3,4,5,7,8
BDATA4: IC23.10(A0) V1.9(E) ; also sheet 2,3,4,5,7,8
BDATA5: IC23.12(A1) V1.10(F) ; also sheet 2,3,4,5,8
BDATA6: IC23.13(A2) V1.11(G) ; also sheet 2,3,4,5,8
BDATA7: IC23.15(A3) V1.12(H) ; also sheet 2,3,4,5,8
BDATA8: V2.2(A) ; also sheet 2,3,4
BDATA9: V2.3(B) ; also sheet 2,3,4
BDATA10: V2.4(C) ; also sheet 2,3,4
BDATA11: V2.5(D) ; also sheet 2,3,4
BDATA12: V2.9(E) ; also sheet 2,3,4
BDATA13: V2.10(F) ; also sheet 2,3,4
BDATA14: V2.11(G) ; also sheet 2,3,4
BDATA15: V2.12(H) ; also sheet 2,3,4
BR-COND: IC27.8(C:O) ; also sheet 2
GND: IC22.2(A<B_I) IC22.4(A>B_I) IC26.7(G) V1.7(-UB) V2.7(-UB) ; also sheet 1,2,5,7
N$43: IC22.5(A>B_O) IC23.4(A>B_I)
N$45: IC22.6(A=B_O) IC23.3(A=B_I)
N$46: IC22.7(A<B_O) IC23.2(A<B_I)
N$47: IC23.7(A<B_O) IC26.3(D1)
N$48: IC23.6(A=B_O) IC26.2(D2)
N$49: IC23.5(A>B_O) IC26.1(D3)
N$50: IC25.4(B:I0) V1.1(Y)
N$51: IC26.15(D4) V1.13(W)
N$52: IC26.14(D5) V2.13(W)
N$53: IC25.5(B:I1) V2.1(Y)
N$54: IC24.5(C:I) IC25.6(B:O)
N$55: IC24.6(C:O) IC26.13(D6)
N$56: IC26.5(Y) IC27.10(C:I1)
OVERFLOW: IC26.12(D7)
VCC: IC22.3(A=B_I) IC26.4(D0) V1.14(+UB) V2.14(+UB) ; also sheet 1,2,7
Unconnected: IC25.8(C:O) IC25.9(C:I0) IC25.10(C:I1) IC25.11(D:O) IC25.12(D:I0) IC25.13(D:I1) IC26.6(W) IC27.1(A:I0) IC27.2(A:I1) IC27.3(A:O) IC27.4(B:I0) IC27.5(B:I1) IC27.6(B:O) IC27.11(D:O) IC27.12(D:I0) IC27.13(D:I1)

### Buses
ACO-DATA[0..7]
BDATA[0..7]
BDATA[8..15]

### Notes on the sheet
- Figure active States
  1=true

## Sheet 7 of 8: Shifter
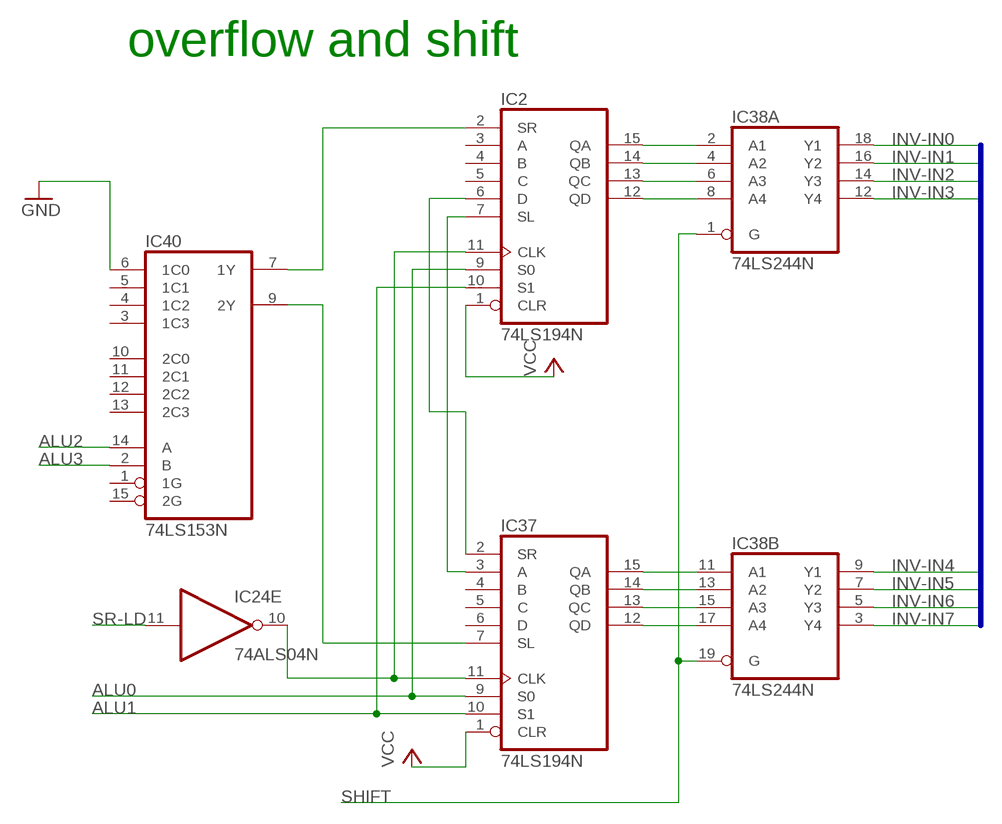
[diagram p6: schematic, sheet 7]

### Parts
IC2  74LS194N  [DIL16]
IC37  74LS194N  [DIL16]
IC38  74LS244N  [DIL20]
IC40  74LS153N  [DIL16]

### Nets
ALU0: IC2.9(S0) IC37.9(S0) ; also sheet 1,2,6
ALU1: IC2.10(S1) IC37.10(S1) ; also sheet 1,2,6
ALU2: IC40.14(A) ; also sheet 1,2,6
ALU3: IC40.2(B)
BDATA3: IC2.6(D) IC37.2(SR) ; also sheet 2,3,4,5,6,8
BDATA4: IC2.7(SL) IC37.3(A) ; also sheet 2,3,4,5,6,8
GND: IC40.6(1C0) ; also sheet 1,2,5,6
INV-IN0: IC38.18(A:Y1) ; also sheet 1,4,5,8
INV-IN1: IC38.16(A:Y2) ; also sheet 1,4,5,8
INV-IN2: IC38.14(A:Y3) ; also sheet 1,4,5,8
INV-IN3: IC38.12(A:Y4) ; also sheet 1,4,5,8
INV-IN4: IC38.9(B:Y1) ; also sheet 1,4,5,8
INV-IN5: IC38.7(B:Y2) ; also sheet 1,4,5,8
INV-IN6: IC38.5(B:Y3) ; also sheet 1,4,5,8
INV-IN7: IC38.3(B:Y4) ; also sheet 1,4,5,8
N$57: IC2.15(QA) IC38.2(A:A1)
N$66: IC2.14(QB) IC38.4(A:A2)
N$69: IC2.13(QC) IC38.6(A:A3)
N$70: IC2.12(QD) IC38.8(A:A4)
N$71: IC37.15(QA) IC38.11(B:A1)
N$72: IC37.14(QB) IC38.13(B:A2)
N$73: IC37.13(QC) IC38.15(B:A3)
N$74: IC37.12(QD) IC38.17(B:A4)
N$75: IC2.2(SR) IC40.7(1Y)
N$76: IC37.7(SL) IC40.9(2Y)
N$80: IC2.11(CLK) IC24.10(E:O) IC37.11(CLK)
SHIFT: IC38.1(A:G) IC38.19(B:G) ; also sheet 1
SR-LD: IC24.11(E:I)
VCC: IC2.1(CLR) IC37.1(CLR) ; also sheet 1,2,6
Unconnected: IC2.3(A) IC2.4(B) IC2.5(C) IC37.4(B) IC37.5(C) IC37.6(D) IC40.1(1G) IC40.3(1C3) IC40.4(1C2) IC40.5(1C1) IC40.10(2C0) IC40.11(2C1) IC40.12(2C2) IC40.13(2C3) IC40.15(2G)

### Buses
INV-IN[0..7]

### Notes on the sheet
- overflow and shift

## Sheet 8 of 8: Add/Sub
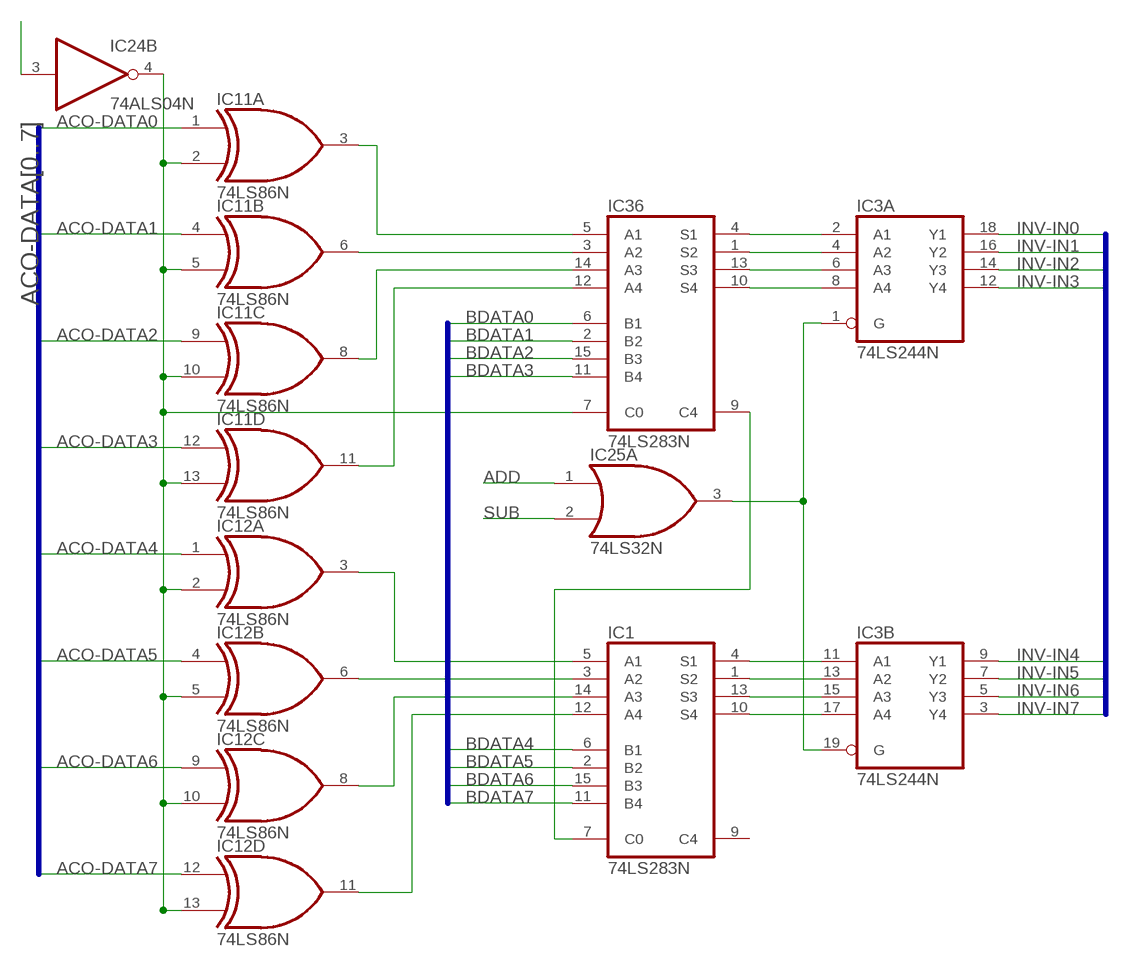
[diagram p7: schematic, sheet 8]

### Parts
IC1  74LS283N  [DIL16]
IC3  74LS244N  [DIL20]
IC11  74LS86N  [DIL14]
IC12  74LS86N  [DIL14]
IC36  74LS283N  [DIL16]

### Nets
-SUB: IC11.2(A:I1) IC11.5(B:I1) IC11.10(C:I1) IC11.13(D:I1) IC12.2(A:I1) IC12.5(B:I1) IC12.10(C:I1) IC12.13(D:I1) IC24.4(B:O) IC36.7(C0)
ACO-DATA0: IC11.1(A:I0) ; also sheet 1,4,5,6
ACO-DATA1: IC11.4(B:I0) ; also sheet 1,4,5,6
ACO-DATA2: IC11.9(C:I0) ; also sheet 1,4,5,6
ACO-DATA3: IC11.12(D:I0) ; also sheet 1,4,5,6
ACO-DATA4: IC12.1(A:I0) ; also sheet 1,4,5,6
ACO-DATA5: IC12.4(B:I0) ; also sheet 1,4,5,6
ACO-DATA6: IC12.9(C:I0) ; also sheet 1,4,5,6
ACO-DATA7: IC12.12(D:I0) ; also sheet 1,4,5,6
ADD: IC25.1(A:I0) ; also sheet 1
BDATA0: IC36.6(B1) ; also sheet 2,3,4,5,6
BDATA1: IC36.2(B2) ; also sheet 2,3,4,5,6
BDATA2: IC36.15(B3) ; also sheet 2,3,4,5,6
BDATA3: IC36.11(B4) ; also sheet 2,3,4,5,6,7
BDATA4: IC1.6(B1) ; also sheet 2,3,4,5,6,7
BDATA5: IC1.2(B2) ; also sheet 2,3,4,5,6
BDATA6: IC1.15(B3) ; also sheet 2,3,4,5,6
BDATA7: IC1.11(B4) ; also sheet 2,3,4,5,6
INV-IN0: IC3.18(A:Y1) ; also sheet 1,4,5,7
INV-IN1: IC3.16(A:Y2) ; also sheet 1,4,5,7
INV-IN2: IC3.14(A:Y3) ; also sheet 1,4,5,7
INV-IN3: IC3.12(A:Y4) ; also sheet 1,4,5,7
INV-IN4: IC3.9(B:Y1) ; also sheet 1,4,5,7
INV-IN5: IC3.7(B:Y2) ; also sheet 1,4,5,7
INV-IN6: IC3.5(B:Y3) ; also sheet 1,4,5,7
INV-IN7: IC3.3(B:Y4) ; also sheet 1,4,5,7
N$25: IC11.6(B:O) IC36.3(A2)
N$26: IC11.8(C:O) IC36.14(A3)
N$27: IC11.11(D:O) IC36.12(A4)
N$28: IC11.3(A:O) IC36.5(A1)
N$29: IC1.5(A1) IC12.3(A:O)
N$30: IC1.3(A2) IC12.6(B:O)
N$31: IC1.14(A3) IC12.8(C:O)
N$32: IC1.12(A4) IC12.11(D:O)
N$33: IC3.2(A:A1) IC36.4(S1)
N$34: IC3.4(A:A2) IC36.1(S2)
N$35: IC3.6(A:A3) IC36.13(S3)
N$36: IC3.8(A:A4) IC36.10(S4)
N$37: IC1.4(S1) IC3.11(B:A1)
N$38: IC1.1(S2) IC3.13(B:A2)
N$39: IC1.13(S3) IC3.15(B:A3)
N$40: IC1.10(S4) IC3.17(B:A4)
N$41: IC1.7(C0) IC36.9(C4)
N$44: IC3.1(A:G) IC3.19(B:G) IC25.3(A:O)
SUB: IC24.3(B:I) IC25.2(A:I1) ; also sheet 1
Unconnected: IC1.9(C4)

### Buses
INV-IN[0..7]
ACO-DATA[0..7]
BDATA[0..7]

## Power pins joined to a net without a drawn wire
GND: IC1.8(GND) IC2.8(GND) IC3.10(P:GND) IC4.8(GND) IC11.7(P:GND) IC12.7(P:GND) IC14.10(P:GND) IC16.10(P:GND) IC18.10(P:GND) IC19.10(GND) IC20.10(P:GND) IC21.10(P:GND) IC22.8(GND) IC23.8(GND) IC24.7(P:GND) IC25.7(P:GND) IC26.8(GND) IC27.7(P:GND) IC28.8(GND) IC29.8(GND) IC30.8(GND) IC31.8(GND) IC32.10(P:GND) IC33.10(GND) IC34.10(P:GND) IC35.10(GND) IC36.8(GND) IC37.8(GND) IC38.10(P:GND) IC39.7(P:GND) IC40.8(GND) IC41.10(GND) IC42.7(P:GND) IC43.7(P:GND) IC44.7(P:GND) IC45.10(P:GND) IC46.10(P:GND) IC47.10(P:GND) IC48.7(P:GND) IC49.7(P:GND) IC50.7(P:GND)
VCC: IC1.16(VCC) IC2.16(VCC) IC3.20(P:VCC) IC4.16(VCC) IC11.14(P:VCC) IC12.14(P:VCC) IC14.20(P:VCC) IC16.20(P:VCC) IC18.20(P:VCC) IC19.20(VCC) IC20.20(P:VCC) IC21.20(P:VCC) IC22.16(VCC) IC23.16(VCC) IC24.14(P:VCC) IC25.14(P:VCC) IC26.16(VCC) IC27.14(P:VCC) IC28.16(VCC) IC29.16(VCC) IC30.16(VCC) IC31.16(VCC) IC32.20(P:VCC) IC33.20(VCC) IC34.20(P:VCC) IC35.20(VCC) IC36.16(VCC) IC37.16(VCC) IC38.20(P:VCC) IC39.14(P:VCC) IC40.16(VCC) IC41.20(VCC) IC42.14(P:VCC) IC43.14(P:VCC) IC44.14(P:VCC) IC45.20(P:VCC) IC46.20(P:VCC) IC47.20(P:VCC) IC48.14(P:VCC) IC49.14(P:VCC) IC50.14(P:VCC)

## Library data of the parts
C1-C44 = rcl:C-US: CAPACITOR, American symbol
IC1 IC36 = 74xx-us:74*283: 4-bit binary FULL ADDER, fast carry
IC2 IC37 = 74xx-us:74*194: 4-bit bidirectional SHIFT REGISTER
IC3 IC14 IC18 IC20 IC21 IC32 IC34 IC38 IC45-IC47 = 74xx-us:74*244: Octal BUFFER and LINE DRIVER, 3-state
IC4 = 74xx-us:74*138: 3-line to 8-line DECODER/DEMULTIPLEXER
IC11 IC12 IC27 IC44 IC50 = 74xx-us:74*86: Quad 2-input EXCLUSIV-OR (XOR) gate
IC16 = 74xx-us:74*240: Octal BUFFER and LINE DRIVER, 3-state
IC19 = 74xx-us:74*374: Octal D type transparent LATCH, edge triggered
IC22 IC23 = 74xx-us:74*85: 4-bit magnitude COMPARATOR
IC24 = 74xx-us:74*04: Hex INVERTER
IC25 IC42 IC43 = 74xx-us:74*32: Quad 2-input OR gate
IC26 = 74xx-us:74*251: 1 of 8 data SELECTOR/MULTIPLEXER, 3-state
IC28-IC31 = 74xx-us:74*192: Synchronous 4-bit UP/DOWN COUNTER
IC33 IC35 IC41 = 74xx-us:74*245: Octal BUS TRANSCEIVER, 3-state
IC39 = 74xx-us:74*00: Quad 2-input NAND gate
IC40 = 74xx-us:74*153: Dual 4-line to 1-line data SELECTOR/MULTIPLEXER
IC48 IC49 = 74xx-us:74*08: Quad 2-input AND gate
RN3 RN4 = resistor-net:RNX8: RESISTOR NETWORK; OC_FARNELL: unknown; OC_NEWARK: unknown
V1 V2 = 74ttl-din:74*4078: 8-input OR/NOR, complementary outputs
X1 = con-vg:FABC96R: CONNECTOR female, 96 pins, type R, rows ABC, grid 2.54 mm